# Altium schematic sheet led.SchDoc
size A
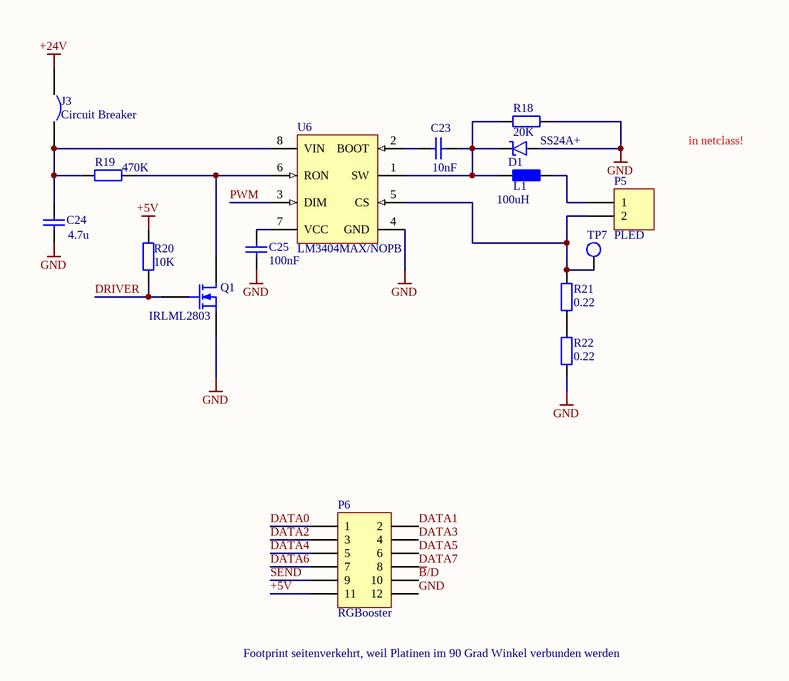
[diagram p0: led.SchDoc]

## Parts
C23  value 10nF  [6-0805_M]  (hidden comment: Cap)
C24  value 4.7u  [C1206]  (hidden comment: Cap)
C25  value 100nF  [6-0805_M]  (hidden comment: Cap)
D1  SS24A+  [DO-214AC]
J3  Circuit Breaker  [SOLDER_JUMPER_24mil]
L1  value 100uH  [ELLCTP]  (hidden comment: Ind)
P5  PLED  [HDR1X2]
P6  RGBooster  [KLEMME_SEITENVERKEHRT]
Q1  IRLML2803  [SOT-23_N]
R18  value 20K  [6-0805_M]  (hidden comment: Res2)
R19  value 470K  [6-0805_M]  (hidden comment: Res2)
R20  value 10K  [6-0805_M]  (hidden comment: Res2)
R21  value 0.22  [C1206]  (hidden comment: Res2)
R22  value 0.22  [C1206]  (hidden comment: Res2)
TP7  TestPoint  [MEASUREMENT_POINT]  (value not drawn)
U6  LM3404MAX/NOPB  [M08A_N]

## Nets
+5V: P6.11 R20.2
+24V: J3.1
GND: C24.1 C25.1 D1.1(A) P6.12 Q1.3(S) R18.1 R22.1 U6.4(GND)
~{B}/D: P6.10
DATA0: P6.1
DATA1: P6.2
DATA2: P6.3
DATA3: P6.4
DATA4: P6.5
DATA5: P6.6
DATA6: P6.7
DATA7: P6.8
DRIVER: Q1.2(G) R20.1
PWM: U6.3(DIM)
SEND: P6.9
NetC23_1: C23.1 U6.2(BOOT)
NetC23_2: C23.2 D1.2(K) L1.1 R18.2 U6.1(SW)
NetC24_2: C24.2 J3.2 R19.1 U6.8(VIN)
NetC25_2: C25.2 U6.7(VCC)
NetL1_2: L1.2 P5.1
NetP5_2: P5.2 R21.2 TP7.1 U6.5(CS)
NetQ1_1: Q1.1(D) R19.2 U6.6(RON)
NetR21_1: R21.1 R22.2

## Notes on the sheet
- in netclass!
- Footprint seitenverkehrt, weil Platinen im 90 Grad Winkel verbunden werden

## Library data of the parts
C23-C25 = Cap: Capacitor; Published: 8-Jun-2000; LatestRevisionDate: 17-Jul-2002; LatestRevisionNote: Re-released for DXP Platform.; PackageReference: RAD-0.3; Publisher: Altium Limited; PackageDescription: Radial Cap, Thru-Hole; 2 Leads; 0.3 in Pin Spacing
D1 = Schottky
L1 = Inductor
P5 = Header 2: Header, 2-Pin; LatestRevisionDate: 17-Jul-2002; LatestRevisionNote: Re-released for DXP Platform.; Publisher: Altium Limited
P6 = Header 6X2: Header, 6-Pin, Dual row; LatestRevisionDate: 17-Jul-2002; LatestRevisionNote: Re-released for DXP Platform.; Publisher: Altium Limited
Q1 = MOSFET-N: N-Channel MOSFET; pin to pad: 1>3 2>1 3>2; Published: 8-Jun-2000; LatestRevisionDate: 17-Jul-2002; LatestRevisionNote: Re-released for DXP Platform.; PackageVersion: 1995/1996; PackageReference: E3; Publisher: Altium Limited; PackageDescription: TO, Flat Index; 3 In-Line, Axial Leads; Body Dia. 4.6mm; Lead Dia. 0.5 mm (max)
R18-R22 = Res2: Resistor; Published: 8-Jun-2000; LatestRevisionDate: 17-Jul-2002; LatestRevisionNote: Re-released for DXP Platform.; PackageReference: AXIAL-0.4; Publisher: Altium Limited; PackageDescription: Axial Device, Thru-Hole; 2 Leads; 0.4 in Pin Spacing
U6 = LM3404MAX/NOPB: 1.0A Constant Current Buck Regulator for High Power LED Drivers, 8-pin Narrow SOIC, Pb-Free; Manufacturer: National Semiconductor; PackageTopMarking: NSZXTT*L3404*MA; PowerWise: Y; CompType: MiscPower; DatasheetVersion: Jun-2007; PackageVersion: revM, May-2009; PackageReference: M08A; PackageDescription: SOIC Narrow, 4.9 x 3.9 x 1.45mm, 8 Lead, 1.27mm Pitch; PartNumber: LM3404MAX/NOPB; RoHS: Y; PinCount: 8; High-Reliability: Y; Code_JEDEC: MS-012-AA; Code_IPC: SOIC127P600-8; ComponentLink1Description: Manufacturer URL; ComponentLink1URL: http://www.national.com/; ComponentLink2Description: LM3404 Datasheet; ComponentLink2URL: http://www.national.com/ds/LM/LM3404.pdf; ComponentLink3Description: LM3404 Web Page; ComponentLink3URL: http://www.national.com/pf/LM/LM3404.html; ComponentLink4Description: M08A Package Page; ComponentLink4URL: http://www.national.com/packaging/folders/m08a.html
J3 = Circuit Breaker: Published: 24-Mar-1999; LatestRevisionDate: 17-Jul-2002; LatestRevisionNote: Re-released for DXP Platform.; PackageReference: SPST-2; Publisher: Altium Limited; PackageDescription: Switch; 2 Leads